# Altium schematic sheet Display.SchDoc
size B; SheetNumber: 3; SheetTotal: 7
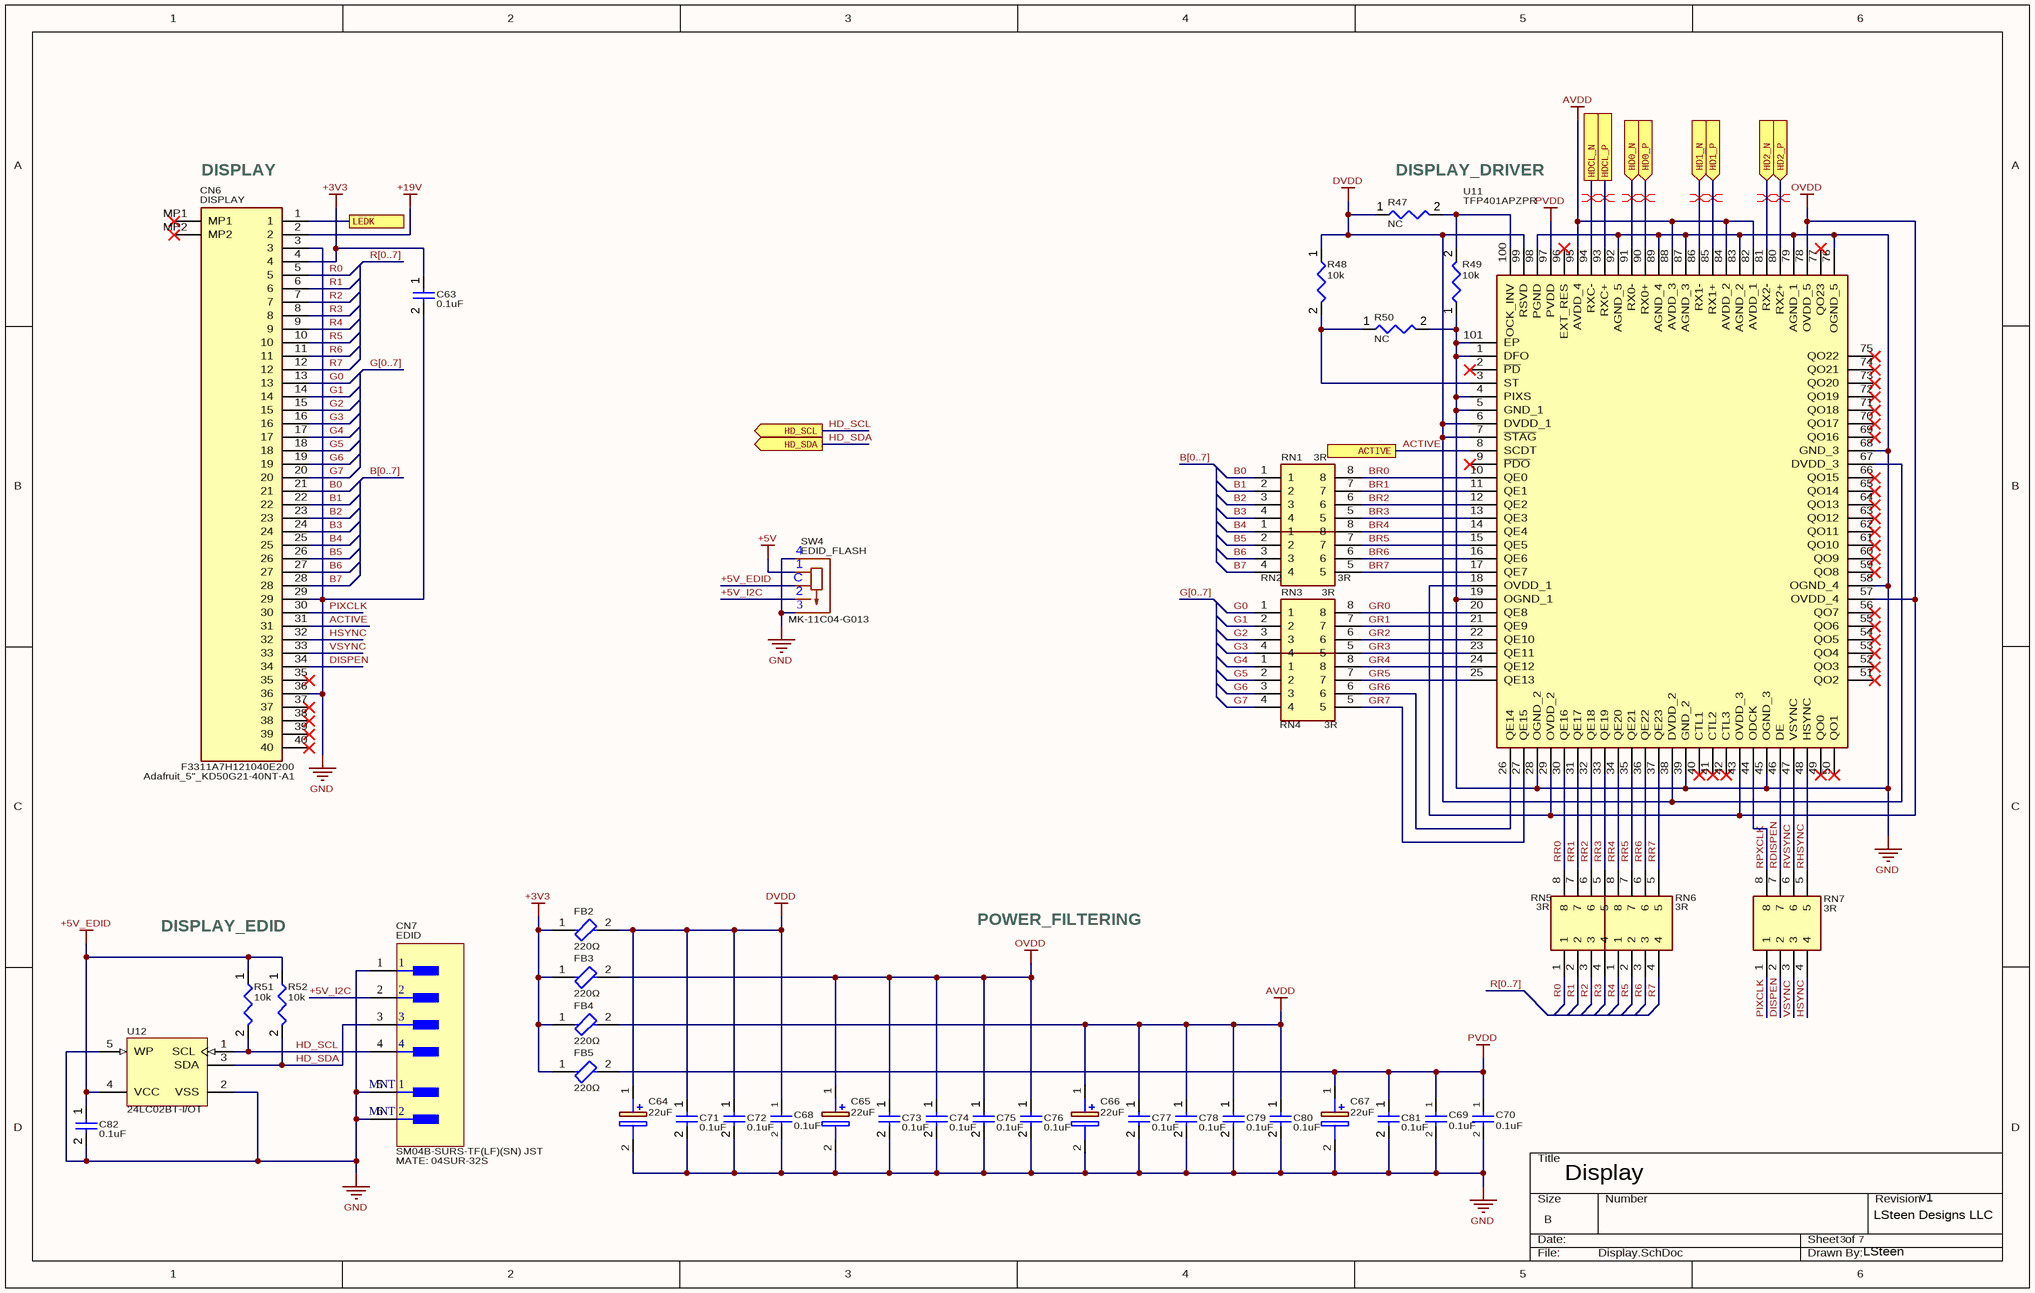
[diagram p0: Display.SchDoc]

## Parts
C63  0.1uF  [CAPC1005X56X25LL10T15]
C64  22uF  [CAPPC2114X150N]
C65  22uF  [CAPPC2114X150N]
C66  22uF  [CAPPC2114X150N]
C67  22uF  [CAPPC2114X150N]
C68  0.1uF  [CAPC1005X55N]
C69  0.1uF  [CAPC1005X55N]
C70  0.1uF  [CAPC1005X55N]
C71  0.1uF  [CAPC1005X56X25LL10T15]
C72  0.1uF  [CAPC1005X56X25LL10T15]
C73  0.1uF  [CAPC1005X56X25LL10T15]
C74  0.1uF  [CAPC1005X56X25LL10T15]
C75  0.1uF  [CAPC1005X56X25LL10T15]
C76  0.1uF  [CAPC1005X56X25LL10T15]
C77  0.1uF  [CAPC1005X56X25LL10T15]
C78  0.1uF  [CAPC1005X56X25LL10T15]
C79  0.1uF  [CAPC1005X56X25LL10T15]
C80  0.1uF  [CAPC1005X56X25LL10T15]
C81  0.1uF  [CAPC1005X56X25LL10T15]
C82  0.1uF  [CAPC1005X56X25LL10T15]
CN6  DISPLAY  [F3311A7H121040E200]
CN7  EDID  [FP-SM04B-SURS-TF_LF_SN-MFG]
FB2  220Ω  [FP-BLM18-0_15-t0_5-IPC_B]
FB3  220Ω  [FP-BLM18-0_15-t0_5-IPC_B]
FB4  220Ω  [FP-BLM18-0_15-t0_5-IPC_B]
FB5  220Ω  [FP-BLM18-0_15-t0_5-IPC_B]
R47  NC  [RESC0402(1005)_L]
R48  10k  [RESC0402(1005)_L]
R49  10k  [RESC0402(1005)_L]
R50  NC  [RESC0402(1005)_L]
R51  10k  [RESC0402(1005)_L]
R52  10k  [RESC0402(1005)_L]
RN1  3R  [YC124JR0733RL]
RN2  3R  [YC124JR0733RL]
RN3  3R  [YC124JR0733RL]
RN4  3R  [YC124JR0733RL]
RN5  3R  [YC124JR0733RL]
RN6  3R  [YC124JR0733RL]
RN7  3R  [YC124JR0733RL]
SW4  EDID_FLASH  [SW-SMD_MK-11C04-G013]
U11  TFP401APZPR  [QFP50P1600X1600X120-100N]
U12  24LC02BT-I/OT  [SOT-23-OT5_L]

## Ports
ACTIVE (see Power[5C]), HD0_N (in, see Module B High-Speed[4B]), HD0_P (in, see Module B High-Speed[4B]), HD1_N (in, see Module B High-Speed[4B]), HD1_P (in, see Module B High-Speed[4B]), HD2_N (in, see Module B High-Speed[4B]), HD2_P (in, see Module B High-Speed[4B]), HD_SCL (out, see Module B High-Speed[3B]), HD_SDA (out, see Module B High-Speed[3B]), HDCL_N (see Module B High-Speed[4B]), HDCL_P (see Module B High-Speed[4B]), LEDK (see Power[6B])

## Nets
+3V3: C63.1 CN6.4 FB2.1 FB3.1 FB4.1 FB5.1
+5V: SW4.1
+5V_EDID: C82.1 R51.1 R52.1 SW4.C U12.4(VCC)
+19V: CN6.2
AVDD: C66.1(+) C77.1 C78.1 C79.1 C80.1 FB4.2 U11.82(AVDD_1) U11.84(AVDD_2) U11.88(AVDD_3) U11.95(AVDD_4)
DVDD: C64.1(+) C68.1 C71.1 C72.1 FB2.2 R47.1 R48.1 U11.6(DVDD_1) U11.7(~{STAG}) U11.38(DVDD_2) U11.67(DVDD_3) U11.99(RSVD)
GND: C63.2 C64.2(-) C65.2(-) C66.2(-) C67.2(-) C68.2 C69.2 C70.2 C71.2 C72.2 C73.2 C74.2 C75.2 C76.2 C77.2 C78.2 C79.2 C80.2 C81.2 C82.2 CN6.3 CN6.29 CN6.36 CN7.1 CN7.5(MNT_1) CN7.6(MNT_2) R49.1 R50.2 SW4.3(NC) SW4.4 U11.1(DFO) U11.4(PIXS) U11.5(GND_1) U11.19(OGND_1) U11.28(OGND_2) U11.39(GND_2) U11.45(OGND_3) U11.58(OGND_4) U11.68(GND_3) U11.76(OGND_5) U11.79(AGND_1) U11.83(AGND_2) U11.87(AGND_3) U11.89(AGND_4) U11.92(AGND_5) U11.98(PGND) U11.101(EP) U12.2(VSS) U12.5(WP)
OVDD: C65.1(+) C73.1 C74.1 C75.1 C76.1 FB3.2 U11.18(OVDD_1) U11.29(OVDD_2) U11.43(OVDD_3) U11.57(OVDD_4) U11.78(OVDD_5)
PVDD: C67.1(+) C69.1 C70.1 C81.1 FB5.2 U11.97(PVDD)
+5V_I2C: CN7.2 SW4.2
ACTIVE: CN6.31 U11.8(SCDT) ; port ACTIVE
B0: CN6.21 RN1.1
B1: CN6.22 RN1.2
B2: CN6.23 RN1.3
B3: CN6.24 RN1.4
B4: CN6.25 RN2.1
B5: CN6.26 RN2.2
B6: CN6.27 RN2.3
B7: CN6.28 RN2.4
BR0: RN1.8 U11.10(QE0)
BR1: RN1.7 U11.11(QE1)
BR2: RN1.6 U11.12(QE2)
BR3: RN1.5 U11.13(QE3)
BR4: RN2.8 U11.14(QE4)
BR5: RN2.7 U11.15(QE5)
BR6: RN2.6 U11.16(QE6)
BR7: RN2.5 U11.17(QE7)
DISPEN: CN6.34 RN7.2
G0: CN6.13 RN3.1
G1: CN6.14 RN3.2
G2: CN6.15 RN3.3
G3: CN6.16 RN3.4
G4: CN6.17 RN4.1
G5: CN6.18 RN4.2
G6: CN6.19 RN4.3
G7: CN6.20 RN4.4
GR0: RN3.8 U11.20(QE8)
GR1: RN3.7 U11.21(QE9)
GR2: RN3.6 U11.22(QE10)
GR3: RN3.5 U11.23(QE11)
GR4: RN4.8 U11.24(QE12)
GR5: RN4.7 U11.25(QE13)
GR6: RN4.6 U11.26(QE14)
GR7: RN4.5 U11.27(QE15)
HD0_N: U11.91(RX0-) ; port HD0_N
HD0_P: U11.90(RX0+) ; port HD0_P
HD1_N: U11.86(RX1-) ; port HD1_N
HD1_P: U11.85(RX1+) ; port HD1_P
HD2_N: U11.81(RX2-) ; port HD2_N
HD2_P: U11.80(RX2+) ; port HD2_P
HD_SCL: CN7.4 R51.2 U12.1(SCL) ; port HD_SCL
HD_SDA: CN7.3 R52.2 U12.3(SDA) ; port HD_SDA
HDCL_N: U11.94(RXC-) ; port HDCL_N
HDCL_P: U11.93(RXC+) ; port HDCL_P
HSYNC: CN6.32 RN7.4
LEDK: CN6.1 ; port LEDK
PIXCLK: CN6.30 RN7.1
R0: CN6.5 RN5.1
R1: CN6.6 RN5.2
R2: CN6.7 RN5.3
R3: CN6.8 RN5.4
R4: CN6.9 RN6.1
R5: CN6.10 RN6.2
R6: CN6.11 RN6.3
R7: CN6.12 RN6.4
RDISPEN: RN7.7 U11.46(DE)
RHSYNC: RN7.5 U11.48(HSYNC)
RPXCLK: RN7.8 U11.44(ODCK)
RR0: RN5.8 U11.30(QE16)
RR1: RN5.7 U11.31(QE17)
RR2: RN5.6 U11.32(QE18)
RR3: RN5.5 U11.33(QE19)
RR4: RN6.8 U11.34(QE20)
RR5: RN6.7 U11.35(QE21)
RR6: RN6.6 U11.36(QE22)
RR7: RN6.5 U11.37(QE23)
RVSYNC: RN7.6 U11.47(VSYNC)
VSYNC: CN6.33 RN7.3
NetR47_2: R47.2 R49.2 U11.100(OCK_INV)
NetR48_2: R48.2 R50.1 U11.3(ST)

Not connected (* = marked no-connect by the designer): CN6 35* 37* 38* 39* 40* MP1* MP2*; U11 2(~{PD})* 9(~{PDO})* 40(CTL1)* 41(CTL2)* 42(CTL3)* 49(QO0)* 50(QO1)* 51(QO2)* 52(QO3)* 53(QO4)* 54(QO5)* 55(QO6)* 56(QO7)* 59(QO8)* 60(QO9)* 61(QO10)* 62(QO11)* 63(QO12)* 64(QO13)* 65(QO14)* 66(QO15)* 69(QO16)* 70(QO17)* 71(QO18)* 72(QO19)* 73(QO20)* 74(QO21)* 75(QO22)* 77(QO23)* 96(EXT_RES)*

## Buses and harness runs
bus B[0..7]
bus G[0..7]
bus R[0..7]

## Layout directives
differential pair; differential pair class HDMI: HD0_N, HD0_P, HD1_N, HD1_P, HD2_N, HD2_P, HDCL_N, HDCL_P

## Notes on the sheet
- (near CN6) DISPLAY
- (near R47) DISPLAY_DRIVER
- (near SW4) MK-11C04-G013
- (near CN6) F3311A7H121040E200
- (near CN6) Adafruit_5"_KD50G21-40NT-A1
- DISPLAY_EDID
- POWER_FILTERING
- (near CN7) MATE: 04SUR-32S
- (near CN7) SM04B-SURS-TF(LF)(SN) JST
- Display
- 3
- 7
- LSteen Designs LLC
- v1
- LSteen

## Library data of the parts
C63 C71-C82 = CMP-001-00001-6: Chip Capacitor, 0.1 uF, +/- 5%, 16 V, 0402 (1005 Metric); Capacitor Type: Ceramic; Voltage Rating: 16V; Max Operating Temperature: 125°C; Min Operating Temperature: -55°C; Case/Package: 0402; Value: 0.1uF; Mounting Technology: SM; Pins: 2; Tolerance: 5%; RoHS Compliant: True
C64-C67 = TACR226K006XTA: Capacitor Polarised; Manufacturer_Name: Kyocera AVX; Datasheet Link: https://datasheet.datasheetarchive.com/originals/dk/DKDS-7/134542.pdf; Height: 1.5mm; Manufacturer_Part_Number: TACR226K006XTA; Mouser Part Number: 581-TACR226K006X; Mouser Price/Stock: https://www.mouser.co.uk/ProductDetail/AVX/TACR226K006XTA?qs=1dejQ3qkUTm9Nv2ucYYT5g%3D%3D; Arrow Part Number: TACR226K006XTA; Arrow Price/Stock: https://www.arrow.com/en/products/tacr226k006xta/avx
C68-C70 = C0402: Height: 0.55mm
CN6 = F3311A7H121040E200: Connector; Manufacturer_Name: Amphenol Communications Solutions; Datasheet Link: https://cdn.amphenol-cs.com/media/wysiwyg/files/documentation/datasheet/flex/ffc_fpc_050mm_f331.pdf; Height: 1.22mm; Manufacturer_Part_Number: F3311A7H121040E200; Supplier 1: Mouser; Supplier Part Number 1: 649-311A7H121040E200
CN7 = CMP-17439-000307-2: CONN HEADER SMD R/A 4POS 0.8MM; NexarPartId: 2647826; Gender: Male; Working Voltage: 30V; Number of Poles: 4; Body Plating: Tin; Wire/Cable Gauge: 32AWG; Current Rating: 500mA; Termination: IDC; Material: Polyamide; Contact Plating: Tin; REACH SVHC: No SVHC; Max Operating Temperature: 85°C; Min Operating Temperature: -25°C; Flammability Rating: UL94 V-0; Number of Rows: 1; Contact Material: Tin; Number of Contacts: 4; Case/Package: SMD/SMT; Voltage Rating: 30V; Lead Pitch: 800µm; Lead Free: Lead Free; Height: 1.75mm; RoHS: Compliant; Voltage Rating (DC): 30V
FB2-FB5 = CMP-06046-002311-1: Chip Ferrite Bead, 0603, 220Ω @ 100MHz, 25%, 0.04Ω, 2.5A; RoHS Compliant: Yes
R47 R50 = CMP-009-00138-3: Chip Resistor, 0 Ohms, +/-5 %, 63 mW, -55 to 155 degC, 0402; Value: 0R; Tolerance: 5%; Power: 63mW; Max Operating Temperature: 155°C; Pins: 2; Min Operating Temperature: -55°C; Case/Package: 0402
R48 R49 R51 R52 = CMP-009-00138-3: Chip Resistor, 10 kOhms, +/-5 %, 63 mW, -55 to 155 degC, 0402; Tolerance: 5%; Power: 63mW; Max Operating Temperature: 155°C; Pins: 2; Value: 10k; Min Operating Temperature: -55°C; Case/Package: 0402
RN1-RN7 = YC124-JR-073RL: Resistor Network; Manufacturer_Name: YAGEO; Manufacturer_Part_Number: YC124-JR-0733RL; Datasheet Link: https://www.yageo.com/upload/media/product/productsearch/datasheet/rchip/PYu-YC_TC_group_51_RoHS_L_9.pdf; Height: 0.55mm; Mouser Part Number: 603-YC124-JR-0733RL; Mouser Price/Stock: https://www.mouser.co.uk/ProductDetail/YAGEO/YC124-JR-0733RL?qs=o9qB%2F%252BVTi4U0zU6ismVxOQ%3D%3D; Arrow Part Number: YC124-JR-0733RL; Arrow Price/Stock: https://www.arrow.com/en/products/yc124-jr-0733rl/yageo?region=nac
SW4 = MK-11C04-G013: SPDT 1A 6V Slide Switch; Supplier 1: LCSC; Supplier Part Number 1: C778185
U11 = TFP401APZPR: Integrated Circuit; Manufacturer_Name: Texas Instruments; Datasheet Link: http://www.ti.com/lit/gpn/TFP401A; Height: 1.2mm; Manufacturer_Part_Number: TFP401APZPR; Mouser Part Number: 595-TFP401APZPR; Mouser Price/Stock: https://www.mouser.co.uk/ProductDetail/Texas-Instruments/TFP401APZPR?qs=lc2O%252BfHJPVYfuIDQbAsRYg%3D%3D; Arrow Part Number: TFP401APZPR; Arrow Price/Stock: https://www.arrow.com/en/products/tfp401apzpr/texas-instruments?region=nac; Supplier 1: Mouser; Supplier Part Number 1: 595-TFP401APZPR
U12 = CMP-0159-00645-1: 2Kbit, 400kHz, 2.5V, I2C Serial EEPROM, 5-Pin SOT-23, Industrial Temperature, Tape and Reel; PackageVersion: revBB, Aug-2009; DatasheetVersion: revJ, Feb-2009; PackageDescription: 5-Lead Plastic Small Outline Transistor (OT) [SOT-23]; PackageReference: SOT-23-OT5; Code_IPC: SOT23-5